# Altium project Rocket logger.PrjPcb
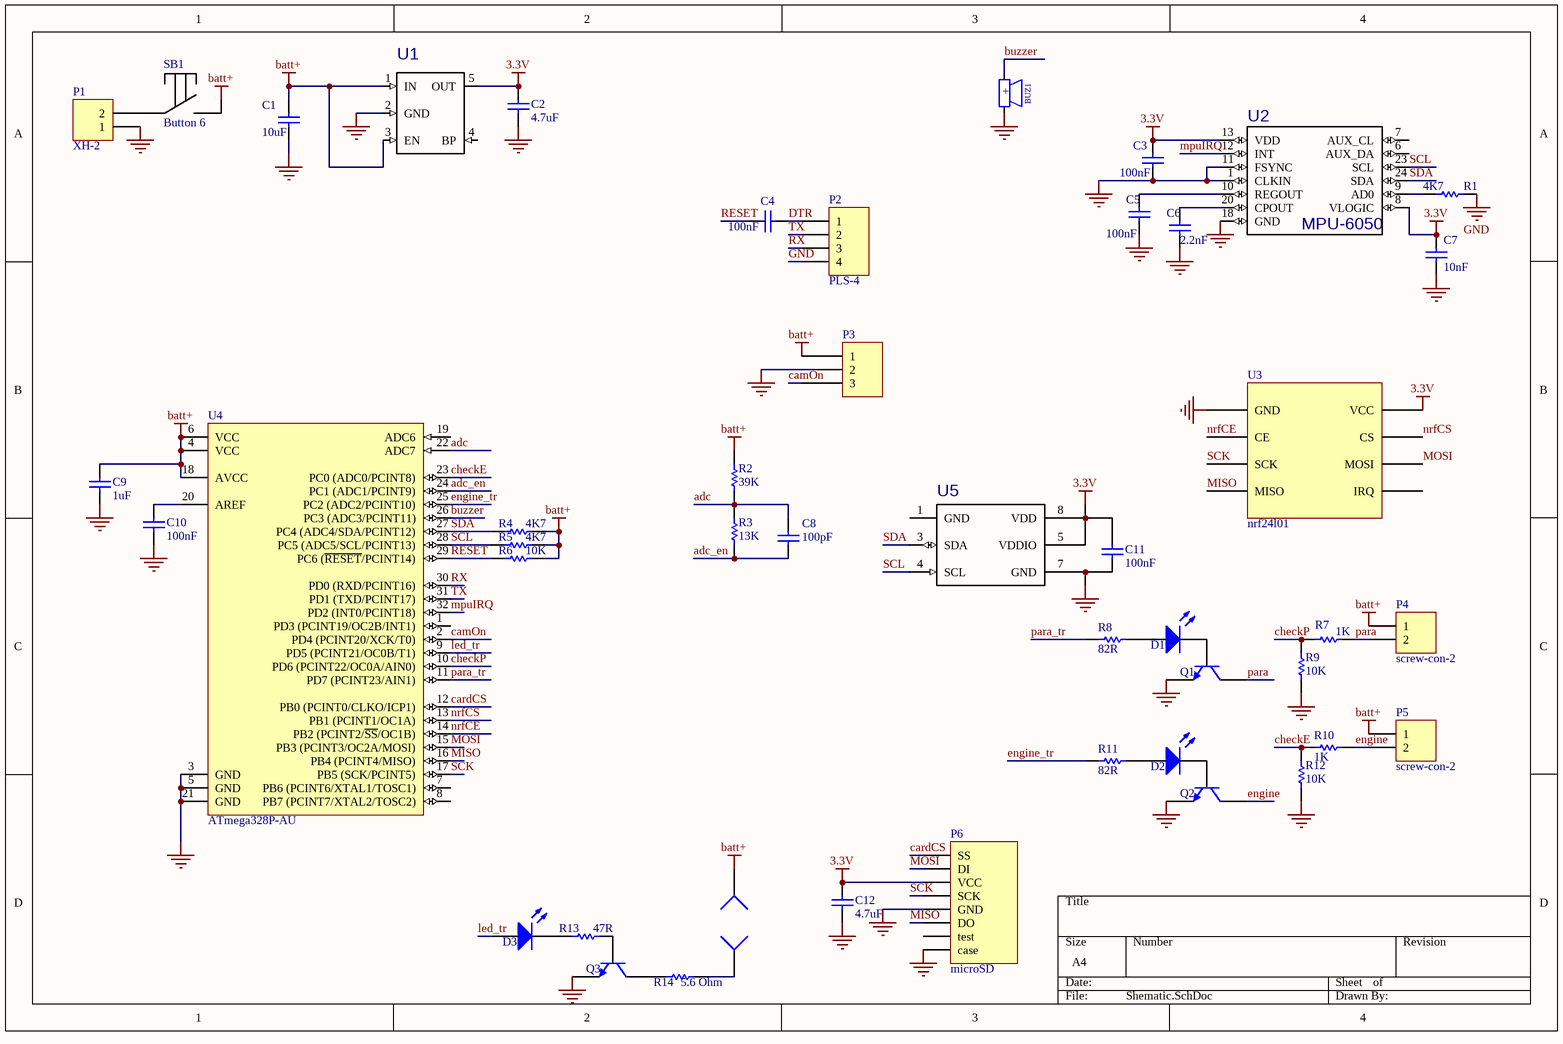
[diagram p0: Shematic.SchDoc]
1 sheet, 47 parts. Net scope: global (net labels, ports and power ports of the same name join across sheets).
Board file: PCB.PcbDoc

## Sheet Shematic.SchDoc
size A4

### Parts
BUZ1  Buzzer  [BUZ12X7,6MM]  (value not drawn)
C1  10uF  [CAPC1206(3216)190_N]
C2  4.7uF  [CAPC0603(1608)100_N]
C3  100nF  [CAPC0603(1608)100_N]
C4  100nF  [CAPC0603(1608)100_N]
C5  100nF  [CAPC0603(1608)100_N]
C6  2.2nF  [CAPC0603(1608)100_L]
C7  10nF  [CAPC0603(1608)100_L]
C8  100pF  [CAPC0805(2012)100_L]
C9  1uF  [CAPC0603(1608)100_L]
C10  100nF  [CAPC0603(1608)100_N]
C11  100nF  [CAPC0603(1608)100_N]
C12  4.7uF  [CAPC0603(1608)100_N]
D1  (no value)  [LED0805]
D2  (no value)  [LED0805]
D3  (no value)  [LED0805]
J1  (no value)  [PIN1]
J2  (no value)  [PIN1]
P1  XH-2  [XH-2]
P2  PLS-4  [PLS-4]
P3  XH2.54-3  [XH2.54-3]  (value not drawn)
P4  screw-con-2  [screw-con-2]
P5  screw-con-2  [screw-con-2]
P6  microSD  [microSD holder]
Q1  MMBT2222A  [INF-SOT23_L]  (value not drawn)
Q2  MMBT2222A  [INF-SOT23_N]  (value not drawn)
Q3  MMBT2222A  [INF-SOT23_M]  (value not drawn)
R1  4K7  [RESC0603(1608)_N]
R2  39K  [6-0805_L]
R3  13K  [RESC0805(2012)_L]
R4  4K7  [RESC0603(1608)_N]
R5  4K7  [RESC0603(1608)_N]
R6  10K  [6-0805_L]
R7  1K  [RESC0805(2012)_N]
R8  82R  [RESC0805(2012)_L]
R9  10K  [RESC0805(2012)_L]
R10  1K  [RESC1206(3216)_N]
R11  82R  [RESC0805(2012)_L]
R12  10K  [RESC0805(2012)_L]
R13  47R  [RESC0805(2012)_N]
R14  5.6 Ohm  [RESC0805(2012)_M]
SB1  Button 6  [Button - 6 mm]
U1  MIC5205  [SOT23-5L_M]  (value not drawn)
U2  MPU-6050  [QFN-24-4MM2]
U3  nrf24l01  [NRF24l01 ant]
U4  ATmega328P-AU  [32A_M]
U5  BMP280  [BMP280]  (value not drawn)

### Nets
3.3V: C2.2 C3.1 C7.2 C11.2 C12.2 P6.4(VCC) U1.5(OUT) U2.8(VLOGIC) U2.13(VDD) U3.2(VCC) U5.5(VDDIO) U5.8(VDD)
batt+: C1.2 C9.2 J1.1 P3.1 P4.1 P5.1 R2.2 R4.2 R5.2 R6.2 SB1.2 U1.1(IN) U1.3(EN) U4.4(VCC) U4.6(VCC) U4.18(AVCC)
GND: BUZ1.1 C1.1 C2.1 C3.2 C5.1 C6.1 C7.1 C9.1 C10.1 C11.1 C12.1 P1.1 P2.4 P3.2 P6.0(case) P6.6(GND) Q1.2(E) Q2.2(E) Q3.2(E) R1.2 R9.1 R12.1 U1.2(GND) U2.1(CLKIN) U2.11(FSYNC) U2.18(GND) U3.1(GND) U4.3(GND) U4.5(GND) U4.21(GND) U5.7(GND)
adc: C8.2 R2.1 R3.1 U4.22(ADC7)
adc_en: C8.1 R3.2 U4.24(PC1_(ADC1/PCINT9))
buzzer: BUZ1.2 U4.26(PC3_(ADC3/PCINT11))
camOn: P3.3 U4.2(PD4_(PCINT20/XCK/T0))
cardCS: P6.2(SS) U4.12(PB0_(PCINT0/CLKO/ICP1))
checkE: R10.1 R12.2 U4.23(PC0_(ADC0/PCINT8))
checkP: R7.1 R9.2 U4.10(PD6_(PCINT22/OC0A/AIN0))
DTR: C4.2 P2.1
engine: P5.2 Q2.3(C) R10.2
engine_tr: R11.1 U4.25(PC2_(ADC2/PCINT10))
led_tr: D3.1(A) U4.9(PD5_(PCINT21/OC0B/T1))
MISO: P6.7(DO) U3.7(MISO) U4.16(PB4_(PCINT4/MISO))
MOSI: P6.3(DI) U3.6(MOSI) U4.15(PB3_(PCINT3/OC2A/MOSI))
mpuIRQ: U2.12(INT) U4.32(PD2_(INT0/PCINT18))
nrfCE: U3.3(CE) U4.14(PB2_(PCINT2/~{SS}/OC1B))
nrfCS: U3.4(CS) U4.13(PB1_(PCINT1/OC1A))
para: P4.2 Q1.3(C) R7.2
para_tr: R8.1 U4.11(PD7_(PCINT23/AIN1))
RESET: C4.1 R6.1 U4.29(PC6_(~{RESET}/PCINT14))
RX: P2.3 U4.30(PD0_(RXD/PCINT16))
SCK: P6.5(SCK) U3.5(SCK) U4.17(PB5_(SCK/PCINT5))
SCL: R5.1 U2.23(SCL) U4.28(PC5_(ADC5/SCL/PCINT13)) U5.4(SCL)
SDA: R4.1 U2.24(SDA) U4.27(PC4_(ADC4/SDA/PCINT12)) U5.3(SDA)
TX: P2.2 U4.31(PD1_(TXD/PCINT17))
NetC5_2: C5.2 U2.10(REGOUT)
NetC6_2: C6.2 U2.20(CPOUT)
NetC10_2: C10.2 U4.20(AREF)
NetD1_1: D1.1(A) R8.2
NetD1_2: D1.2(K) Q1.1(B)
NetD2_1: D2.1(A) R11.2
NetD2_2: D2.2(K) Q2.1(B)
NetD3_2: D3.2(K) R13.1
NetJ2_1: J2.1 R14.2
NetP1_2: P1.2 SB1.1
NetQ3_1: Q3.1(B) R13.2
NetQ3_3: Q3.3(C) R14.1
NetR1_1: R1.1 U2.9(AD0)

Not connected (* = marked no-connect by the designer): P6 9(test); SB1 3 4 5 6; U1 4(BP); U2 6(AUX_DA) 7(AUX_CL); U3 8(IRQ); U4 1(PD3_(PCINT19/OC2B/INT1)) 7(PB6_(PCINT6/XTAL1/TOSC1)) 8(PB7_(PCINT7/XTAL2/TOSC2)) 19(ADC6); U5 1(GND)

### Notes on the sheet
- (in symbol Buzzer) +

### Library data of the parts
BUZ1 = Buzzer: BUZ12X7,6MM; Value: KPX-1203B
C1 = CMP-1037-04983-1: CAP 10uF 50V ±20% 1206 (3216 Metric) Thickness 1.9mm SMD; Tolerance: Â±20%; Case-Metric: 3216; Case-EIA: 1206; Technology: SMT; Max Thickness: 1.9 mm; Rated Voltage: 50 V; Value: 10uF
C2 C12 = CMP-1035-02789-1: CAP 4.7uF 16V ±20% 0603 (1608 Metric) Thickness 1mm SMD; Case-EIA: 0603; Tolerance: Â±20%; Case-Metric: 1608; Max Thickness: 1 mm; Rated Voltage: 16 V; Technology: SMT; Value: 4.7uF
C3-C5 C10 C11 = CMP-1035-02585-1: CAP 100nF 16V ±20% 0603 (1608 Metric) Thickness 1mm SMD; Case-EIA: 0603; Tolerance: Â±20%; Case-Metric: 1608; Technology: SMT; Rated Voltage: 16 V; Value: 100nF; Max Thickness: 1 mm
C6 = CMP-1035-02030-1: CAP 2.2nF 16V ±20% 0603 (1608 Metric) Thickness 1mm SMD; Case-Metric: 1608; Case-EIA: 0603; Tolerance: Â±20%; Value: 2.2nF; Technology: SMT; Rated Voltage: 16 V; Max Thickness: 1 mm
C7 = CMP-1035-02312-1: CAP 10nF 16V ±20% 0603 (1608 Metric) Thickness 1mm SMD; Case-EIA: 0603; Tolerance: Â±20%; Case-Metric: 1608; Max Thickness: 1 mm; Value: 10nF; Technology: SMT; Rated Voltage: 16 V
C8 = CMP-1036-02260-1: CAP 200pF 16V ±10% 0805 (2012 Metric) Thickness 1mm SMD; Case-EIA: 0805; Case-Metric: 2012; Tolerance: Â±10%; Value: 200pF; Technology: SMT; Max Thickness: 1 mm; Rated Voltage: 16 V
C9 = CMP-1035-02738-1: CAP 1uF 16V ±20% 0603 (1608 Metric) Thickness 1mm SMD; Case-Metric: 1608; Case-EIA: 0603; Tolerance: Â±20%; Value: 1uF; Rated Voltage: 16 V; Max Thickness: 1 mm; Technology: SMT
D1-D3 = LED0: Typical INFRARED GaAs LED; Published: 8-Jun-2000; LatestRevisionDate: 08-Jul-2005; LatestRevisionNote: Mech Layer 1 removed.; PackageReference: LED-0; Publisher: Altium Limited; PackageDescription: LED; 2 Leads
J1 J2 = Socket: LatestRevisionDate: 17-Jul-2002; LatestRevisionNote: Re-released for DXP Platform.; Publisher: Altium Limited
P1 = XH-2: XH 2-pin, 2.4mm pitch; LatestRevisionDate: 17-Jul-2002; LatestRevisionNote: Re-released for DXP Platform.; Publisher: Altium Limited
P2 = PLS-4: Single row pins
P4 P5 = screw-con-2: screw con 2-pin, 5.08mm pitch; LatestRevisionDate: 17-Jul-2002; LatestRevisionNote: Re-released for DXP Platform.; Publisher: Altium Limited
P6 = microSD: microSD holder; LatestRevisionDate: 17-Jul-2002; LatestRevisionNote: Re-released for DXP Platform.; Publisher: Altium Limited
Q1-Q3 = CMP-1178-00009-1: NPN Silicon Switching Transistor, 40 V VCEO, 600 mA IC, SOT23, Reel, Green; Manufacturer: Infineon; VCBO (max): 75 V; IC: 150 mA; ICBO (max): 10 nA; VCE (max): 10 V; VCEO (max): 40 V; VEBO (max): 6 V; IC (max): 600 mA; Green: TRUE; ComponentLink1URL: http://www.infineon.com/; ComponentLink2Description: Datasheet; Mounting Technology: Surface Mount; ComponentLink3URL: http://www.infineon.com/dgdl/SOT23-Package_Overview.pdf?folderId=db3a30431936bc4b0119532290053c66&fileId=db3a30431936bc4b0119533468123c85; PackageDescription: 3-Pin Small Outline Transistor Package, 1.3 x 2.9 mm Body, 0.95 mm Pitch; Packing: Reel; PackageVersion: Apr-08; PartNumber: MMBT2222A; Polarity: NPN; ComponentLink2URL: http://www.infineon.com/dgdl/smbt2222a_mmbt2222a.pdf?folderId=db3a30431441fb5d011445fab851018e&fileId=db3a30431441fb5d011445fbaff0018f; PackageReference: SOT23; VCE: 10 V; ComponentLink1Description: Manufacturer URL; ComponentLink3Description: Package Specification
R1 R4 R5 = CMP-1012-00090-1: 4K7 0.1W 5% 0603 (1608 Metric)  SMD; Case-Metric: 1608; Value: 4700.00 Ohm; Case-EIA: 0603; Tolerance: 5 %; Technology: SMT; Power: 0.1 W
R2 = CMP-1014-00112-1: 39K 0.25W 5% 1206 (3216 Metric)  SMD; Value: 39000.00 Ohm; Case-Metric: 3216; Case-EIA: 1206; Tolerance: 5 %; Power: 0.25 W; Technology: SMT
R3 = CMP-1013-00101-1: 13K 0.125W 5% 0805 (2012 Metric)  SMD; Case-Metric: 2012; Case-EIA: 0805; Value: 13000.00 Ohm; Power: 0.125 W; Tolerance: 5 %; Technology: SMT
R6 = CMP-1014-00098-1: Power: 0.25 W; Tolerance: 5 %; Value: 10000.00 Ohm; Case-Metric: 3216; Case-EIA: 1206; Technology: SMT
R7 = CMP-1013-00074-1: 1K 0.125W 5% 0805 (2012 Metric)  SMD; Case-EIA: 0805; Case-Metric: 2012; Value: 1000.00 Ohm; Technology: SMT; Power: 0.125 W; Tolerance: 5 %
R8 R11 = CMP-1013-00011-1: 2R4 0.125W 5% 0805 (2012 Metric)  SMD; Case-EIA: 0805; Case-Metric: 2012; Technology: SMT; Power: 0.125 W; Value: 82R; Tolerance: 5 %
R9 R12 = CMP-1013-00098-1: 10K 0.125W 5% 0805 (2012 Metric)  SMD; Case-EIA: 0805; Case-Metric: 2012; Value: 10000.00 Ohm; Power: 0.125 W; Technology: SMT; Tolerance: 5 %
R10 = CMP-1014-00074-1: 1K 0.25W 5% 1206 (3216 Metric)  SMD; Value: 1000.00 Ohm; Case-Metric: 3216; Case-EIA: 1206; Tolerance: 5 %; Power: 0.25 W; Technology: SMT
R13 = CMP-1013-00060-1: 270R 0.125W 5% 0805 (2012 Metric)  SMD; Case-Metric: 2012; Case-EIA: 0805; Value: 47R; Power: 0.125 W; Technology: SMT; Tolerance: 5 %
R14 = CMP-1013-00050-1: 100R 0.125W 5% 0805 (2012 Metric)  SMD; Case-EIA: 0805; Case-Metric: 2012; Tolerance: 5 %; Power: 0.125 W; Technology: SMT; Value: 5.6 Ohm
U1 = MIC5205: LDO (KB33); Value: *
U3 = NRF24L01: Wirless module 2.4GHz
U4 = CMP-0095-00269-2: 8-bit AVR Microcontroller, 32KB Flash, 1KB EEPROM, 2KB SRAM, 32-pin TQFP, Industrial Grade (-40°C to 85°C); PackageDescription: 32-Lead, 7x7x1.0 mm Body, 0.8mm Lead Pitch, Thin Profile Plastic Quad Flat Package (TQFP); DatasheetVersion: revD, May-2011; RevisionNote: DatasheetVersion & PackageVersion updated. URLs added.; ComponentLink1URL: http://www.atmel.com/; ComponentLink2Description: ATmega48A/48PA/88A/88PA/168A/168PA/328/328P Datasheet; Code_JEDEC: MS-026-ABA; ComponentLink1Description: Manufacturer URL; PackageReference: 32A; ComponentLink3Description: ATmega48A/48PA/88A/88PA/168A/168PA/328/328P Summary; ComponentLink2URL: http://www.atmel.com/dyn/resources/prod_documents/doc8271.pdf; PackageVersion: revC, Oct-2010; ComponentLink3URL: http://www.atmel.com/dyn/resources/prod_documents/8271S.pdf
U2 = MPU-6050: Value: *
U5 = BMP280: Value: *